# Altium schematic sheet BoardB-Power.SchDoc
size A; SheetNumber: 3; SheetTotal: 3
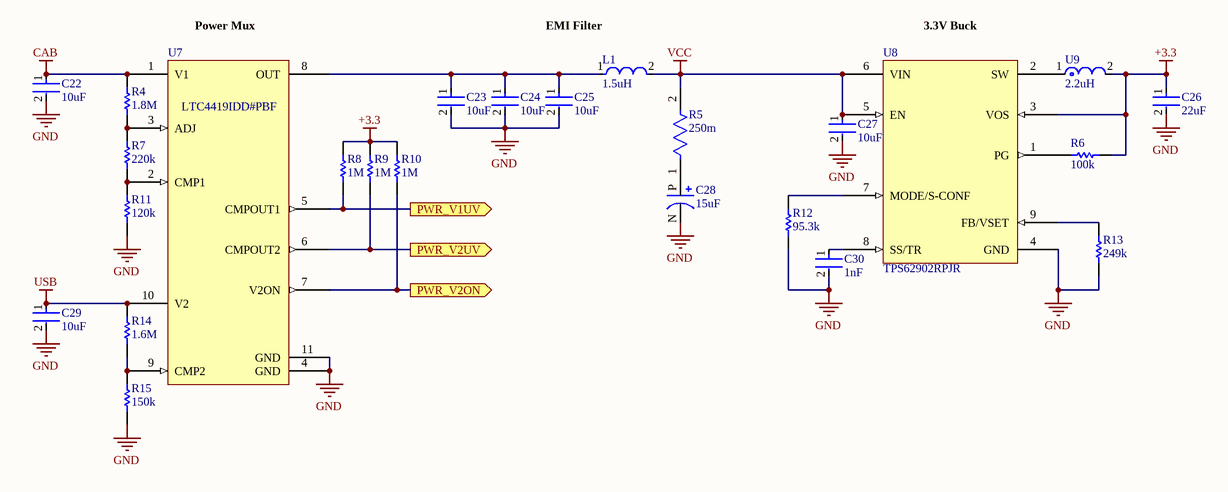
[diagram p0: BoardB-Power.SchDoc]

## Parts
C22  10uF  [FP-GRM21B-0_15-IPC_C]
C23  10uF  [FP-GRM21B-0_15-IPC_C]
C24  10uF  [FP-GRM21B-0_15-IPC_C]
C25  10uF  [FP-GRM21B-0_15-IPC_C]
C26  22uF  [FP-CL21-IPC_C]
C27  10uF  [FP-GRM21B-0_15-IPC_C]
C28  15uF  [16TQC15M]
C29  10uF  [FP-GRM21B-0_15-IPC_C]
C30  1nF  [FP-CL957-IPC_C]
L1  1.5uH  [FP-DFE252010C-IPC_C]
R4  1.8M  [RESC2013X70X40NL20T20]
R5  250m  [FP-CSR1206-IPC_A]
R6  100k  [RESC1005X40X25NL05T10]
R7  220k  [RESC1005X40X25ML05T05]
R8  1M  [RESC0603X28X15NL05T05]
R9  1M  [RESC0603X28X15NL05T05]
R10  1M  [RESC0603X28X15NL05T05]
R11  120k  [RESC1608X55X25NL10T15]
R12  95.3k  [RESC1005X40X25NL05T10]
R13  249k  [RESC1005X40X25NL05T05]
R14  1.6M  [RESC3216X70X50LL05T20]
R15  150k  [RESC1005X40X25NL05T10]
U7  LTC4419IDD#PBF  [LTC4419IDD#PBF]
U8  TPS62902RPJR  [TPS62902RPJR]
U9  2.2uH  [FP-FDSD0420-MFG]

## Ports
PWR_V1UV (out), PWR_V2ON (out), PWR_V2UV (out)

## Nets
+3.3: C26.1 R6.2 R8.2 R9.2 R10.2 U8.3(VOS) U9.2
CAB: C22.1 R4.2 U7.1(V1)
GND: C22.2 C23.2 C24.2 C25.2 C26.2 C27.2 C28.N C29.2 C30.2 R11.2 R12.1 R13.2 R15.1 U7.4(GND) U7.11(GND) U8.4(GND)
USB: C29.1 R14.2 U7.10(V2)
VCC: C27.1 L1.2 R5.2 U8.5(EN) U8.6(VIN)
PWR_V1UV: R8.1 U7.5(CMPOUT1) ; port PWR_V1UV
PWR_V2ON: R10.1 U7.7(V2ON) ; port PWR_V2ON
PWR_V2UV: R9.1 U7.6(CMPOUT2) ; port PWR_V2UV
NetC23_1: C23.1 C24.1 C25.1 L1.1 U7.8(OUT)
NetC28_P: C28.P R5.1
NetC30_1: C30.1 U8.8(SS/TR)
NetR4_1: R4.1 R7.2 U7.3(ADJ)
NetR6_1: R6.1 U8.1(PG)
NetR7_1: R7.1 R11.1 U7.2(CMP1)
NetR12_2: R12.2 U8.7(MODE/S-CONF)
NetR13_1: R13.1 U8.9(FB/VSET)
NetR14_1: R14.1 R15.2 U7.9(CMP2)
NetU8_2: U8.2(SW) U9.1

## Notes on the sheet
- (near U7) Power Mux
- EMI Filter
- (near U8) 3.3V Buck

## Library data of the parts
C22-C25 C27 C29 = CMP-2007-03541-2: Chip Multilayer Ceramic Capacitors for General Purpose, 0805, 10uF, X5R, 15%, 10%, 25V; Length: 2mm; Depth: 1.25mm; Termination: SMD/SMT; Voltage: 25V; Height: 1.25mm; Material: Ceramic; Thickness: 0.053inch; Radiation Hardening: No; Min Operating Temperature: -55°C; Width: 0.049inch; Package Quantity: 1; Mount: Surface Mount; Dielectric: X5R; Packaging: Tape and Reel; Capacitance: 10uF; Voltage Rating (DC): 25V; Lead Free: Lead Free; Max Operating Temperature: 85°C; Case Code (Imperial): 0805; Case/Package: 0805; Tolerance: 10%; Voltage Rating: 25V; Case Code (Metric): 2012
C26 = CMP-13271-002990-1: CL21 Series 0805 22uF 16V ±20% Tolerance X5R Multilayer Ceramic Chip Capacitor; Case Code (Imperial): 0805; Capacitance: 22uF; Max Operating Temperature: 85°C; Min Operating Temperature: -55°C; Packaging: Tape and Reel; Case Code (Metric): 2012; Case/Package: 0805; Mount: Surface Mount; Tolerance: 20%; Thickness: 0.037inch; Voltage Rating: 16V; Width: 0.049inch; Length: 0.079inch
C28 = 16TQC15M: Polymer capacitor 15 uF 16 VDC, 16TQC15M, Panasonic Automotive & Industrial Systems; Tolerance: 20%; Voltage Rating: 16V; ESR (Equivalent Series Resistance): 90mR; Ripple Current: 1A; Leakage Current: 72uA; Polarity: Polar; Life (Hours): 2000Hour; Dissipation Factor: 10%; Supplier 1: Digi-Key; RoHS: Yes; Stock 1: 1294; Pricing 1: 1=2.02000, 10=1.59300, 50=1.38060, 100=1.19470, 500=0.90264, 1000=0.79646 (USD); Mount: Surface Mount; Case/Package: 1411; Number of Pins: 2; Case Code (Metric): 3528; Case Code (Imperial): 1411; Min Operating Temperature: -55°C; Max Operating Temperature: 105°C; Capacitance: 15uF; Package Quantity: 2000; Packaging: Tape and Reel; Voltage Rating (DC): 16V; Termination: SMD/SMT; Voltage: 16V; Features: General Purpose; Length: 3.5mm; Width: 0.11inch; Height: 1.9mm; Height - Seated (Max): 0.079inch; Depth: 2.8mm; Radiation Hardening: No; REACH SVHC: No SVHC; Lead Free: Lead Free; RoHS Compliant: Yes; ComponentLink1URL: https://datasheet.ciiva.com/25784/1734368-25784922.pdf?src-supplier=Farnell; ComponentLink1Description: https://datasheet.ciiva.com/25784/1734368-25784922.pdf?src-supplier=Farnell; ComponentLink2URL: https://datasheet.ciiva.com/48675/aaa8000ce14-48675000.pdf?src-supplier=Avnet; ComponentLink2Description: https://datasheet.ciiva.com/48675/aaa8000ce14-48675000.pdf?src-supplier=Avnet; ComponentLink3URL: https://datasheet.ciiva.com/48543/tqc-series-eng-tds-48543116.pdf?src-supplier=Distrelec; ComponentLink3Description: https://datasheet.ciiva.com/48543/tqc-series-eng-tds-48543116.pdf?src-supplier=Distrelec; Manufacturer Part Number: 16TQC15M; Manufacturer: Panasonic; Supplier Part Number 1: P16485CT-ND; Category: Tantalum Capacitors
C30 = CMP-13271-004091-1: Cap Ceramic 1nF 50V X7R ±10% SMD 0402 +125°C Paper T/R; Tolerance: 10%; Material: Ceramic; Lead Free: Lead Free; Dielectric: X7R; Min Operating Temperature: -55°C; Mount: Surface Mount; Package Quantity: 1; Width: 0.02inch; Max Operating Temperature: 125°C; Capacitance: 1nF; Case/Package: 0402; Depth: 0.5mm; Contact Plating: Tin; Height: 0.5mm; Length: 1mm; Case Code (Imperial): 0402; Voltage Rating (DC): 50V; Voltage: 50V; Radiation Hardening: No; Thickness: 0.022inch; Case Code (Metric): 1005; Packaging: Tape and Reel; Voltage Rating: 50V
L1 = CMP-06042-002962-1: Shielded Wirewound Inductor 1.5uH  1900mA 0.108Ω 1008 (2520); Core Material: Ferrite; DC Resistance (DCR): 108mR; Max DC Current: 2.3A; Test Frequency: 1MHz; Tolerance: 20%; Current Rating: 2.1A; Case Code (Imperial): 1008; Depth: 2mm; Height - Seated (Max): 0.039inch; Case/Package: 1008; Width: 0.079inch; Case Code (Metric): 2520; Max Operating Temperature: 85°C; Inductance: 1.5uH; Resistor Type: Wirewound; Packaging: Tape and Reel; Mount: Surface Mount; Shielding: Shielded; Length: 0.098inch; Min Operating Temperature: -40°C
R4 = CMP-1013-00876-2: Manufacturer: Panasonic; Part Number: ERJ-6ENF1804V
R5 = CMP-26527-002310-1: General Purpose Thick Film Chip Resistor, 1206, 0.25Ω, 1%, 100ppm/°C, 0.5W; Resistance: 250mR; Power Rating: 500mW; RoHS Compliant: Yes; Resistor Type: Thick Film; Min Operating Temperature: -55°C; Temperature Coefficient: 100ppm/°C; Tolerance: 1%; Width: 0.061inch; Number of Terminations: 2; Length: 0.12inch; Max Power Dissipation: 500mW; Height: 0.026inch; Lead Free: Lead Free; Packaging: Tape and Reel; Case Code (Metric): 3216; Series: CSR; Case/Package: 1206; Case Code (Imperial): 1206; Mount: Surface Mount; Termination: Wraparound; Max Operating Temperature: 155°C; Contact Plating: Tin
R6 = CMP-2002-07343-1: Part Number: RC0402FR-07100KL; Manufacturer: Yageo / Phycomp
R7 = CMP-2002-01134-1: Manufacturer: Panasonic; Part Number: ERJ2RKF2203X
R8-R10 = CMP-2004-00269-1: Part Number: CRCW02011M00FKED; Manufacturer: Vishay Dale
R11 = CMP-1659-00024-2: Chip Resistor, 120 KOhm, +/- 1%, 100 mW, -55 to 155 degC, 0603 (1608 Metric), RoHS, Tape and Reel; Capacitance: 22 pF; Voltage Rating (DC): 100 V; Tolerance: 10%; Type (Capacitors): C0G; Case\Package: Radial; Package Quantity: 500; ComponentLink2URL: http://www.yageo.com/documents/recent/PYu-RC_Group_51_RoHS_L_04.pdf; RoHSCompliant: true; Lead Pitch: 2.54 mm; Length: 5.33 mm; PackageDescription: 2-Pin Surface Mount Device, Body 1.6 x 0.8 mm; Height: 2.54 mm; Voltage Rating: 100 V; ComponentLink1Description: Manufacturer URL; ComponentLink1URL: http://www.yageo.com/; Min Operating Temperature: -55 degC; ComponentLink2Description: Datasheet; Width: 3.81 mm; Packaging: Bulk; Mount: Through Hole; Radiation Hardening: No; DatasheetVersion: Rev. 4, 02/2016; PackageReference: 0603; Max Operating Temperature: 125 degC
R12 = CMP-2002-07843-1: Part Number: RC0402FR-0795K3L; Manufacturer: Yageo / Phycomp
R13 = CMP-2002-00807-1: Manufacturer: Panasonic; Part Number: ERJ-2RKF2493X
R14 = CMP-2003-00137-1: Part Number: ERJ-8ENF1604V; Manufacturer: Panasonic
R15 = CMP-2002-07400-1: Part Number: RC0402FR-07150KL; Manufacturer: Yageo / Phycomp
U7 = LTC4419IDD#PBF: IC SOURCE SELECTOR SWITCH 10DFN; Manufacturer: Analog Devices / Linear Technology; Min Supply Voltage: 1.8V; Max Supply Voltage: 18V; Supplier 1: Digi-Key; RoHS: Yes; Stock 1: 2936; Pricing 1: 1=7.57000, 10=6.83700, 25=6.51920, 100=5.66040, 250=5.40600, 500=4.92900, 1000=4.50000 (USD); Case/Package: DFN; Number of Pins: 10; Min Operating Temperature: 0°C; Max Operating Temperature: 70°C; REACH SVHC: No SVHC; RoHS Compliant: Yes; ComponentLink1URL: http://www.farnell.com/datasheets/2124270.pdf?src-supplier=Farnell; ComponentLink1Description: http://www.farnell.com/datasheets/2124270.pdf?src-supplier=Farnell; ComponentLink2URL: http://www.linear.com/docs/54122?src-supplier=Digi-Key; ComponentLink2Description: http://www.linear.com/docs/54122?src-supplier=Digi-Key; ComponentLink3URL: http://www.farnell.com/datasheets/2124270.pdf?src-supplier=Element14; ComponentLink3Description: http://www.farnell.com/datasheets/2124270.pdf?src-supplier=Element14; Category: Power Management ICs; Manufacturer Part Number: LTC4419IDD#PBF; Supplier Part Number 1: LTC4419IDD#PBF-ND
U8 = TPS62902RPJR: Manufacturer: Texas Instruments; Supplier 1: Digi-Key; RoHS: Yes; Stock 1: 7457; Pricing 1: 1=1.81000, 10=1.62400, 25=1.53160, 100=1.30500, 250=1.22536, 500=1.07220, 1000=0.96526 (USD); Supplier Part Number 1: 296-TPS62902RPJRCT-ND; Manufacturer Part Number: TPS62902RPJR
U9 = CMP-06042-016242-1: FIXED IND 2.2UH 3.6A 47 MOHM SMD; Test Frequency: 100kHz; Core Material: Ferrite; Shielding: Shielded; DC Resistance (DCR): 47mR; Saturation Current: 4.1A; Tolerance: 20%; Current Rating: 3.6A; Height - Seated (Max): 0.078inch; RoHS Compliant: Yes; Resistor Type: Wirewound; Case/Package: Nonstandard; Packaging: Tape and Reel; Length: 0.165inch; Inductance: 2.2uH; Width: 0.165inch; Mount: Surface Mount